# Altium schematic sheet Hardware.SchDoc
size A3; SheetNumber: 1; SheetTotal: 1
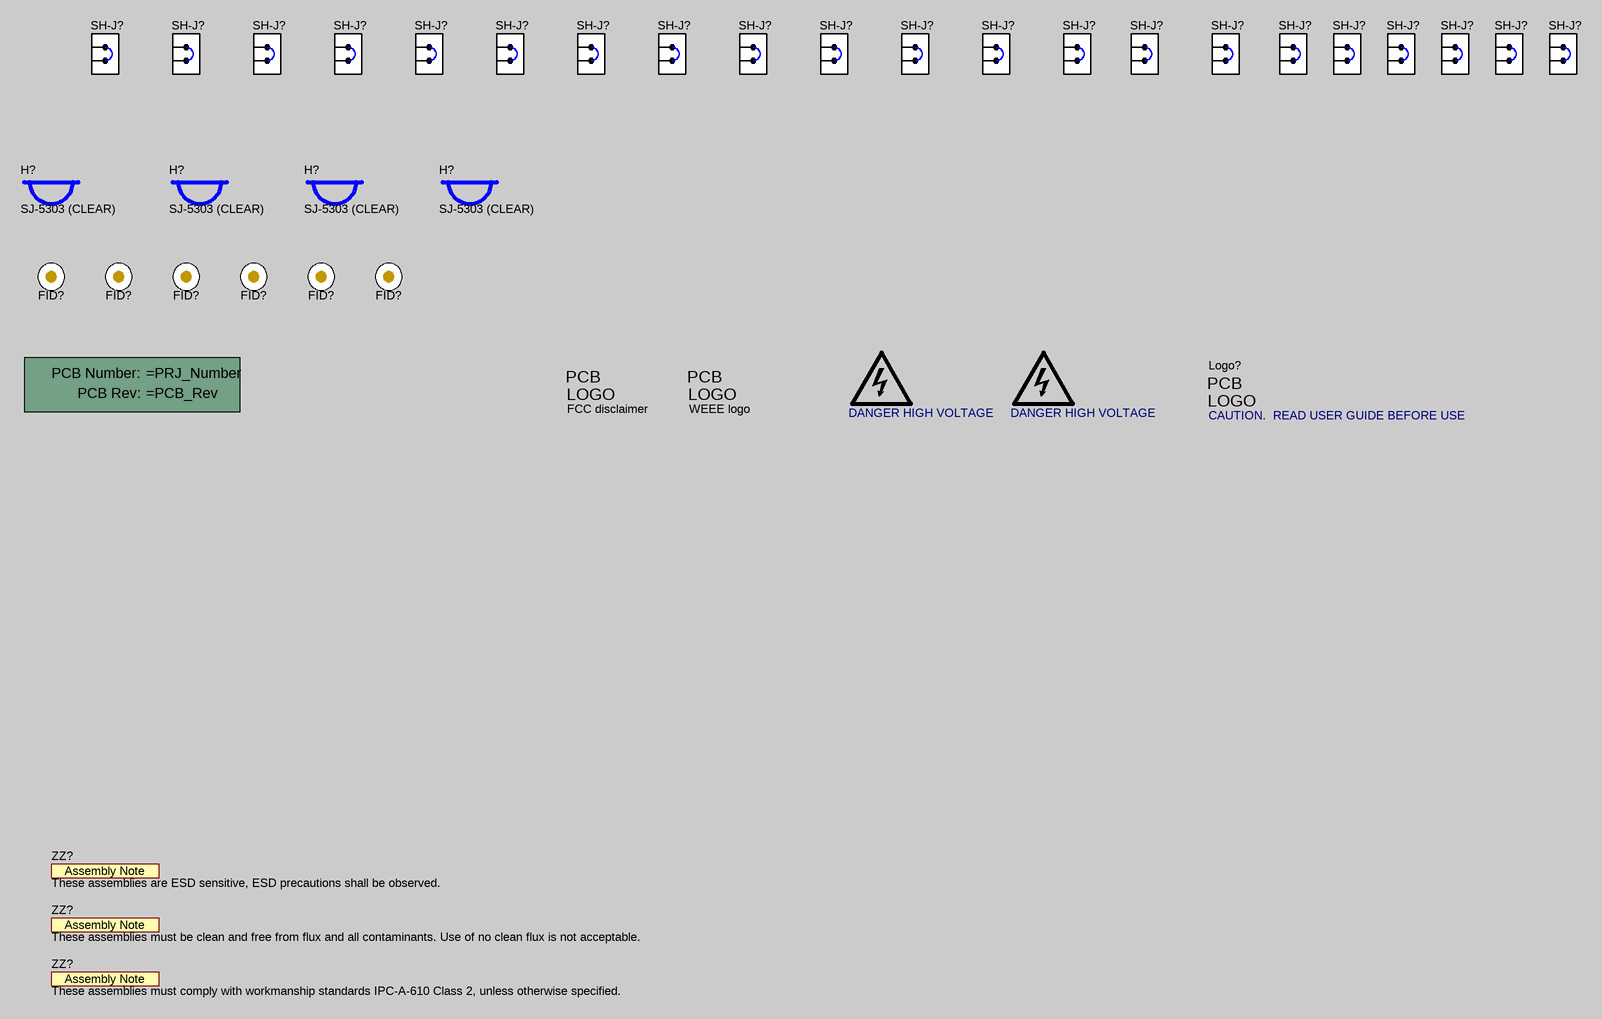
[diagram p0: Hardware.SchDoc]

## Parts
(Parts that share a designator on the sheet are numbered #1, #2 ... from top to bottom, then left to right.)
!PCB?  Printed Circuit Board  (value not drawn)  (mechanical)
FID?#1  Fiducial  [Fiducial10-20]  (value not drawn)
FID?#2  Fiducial  [Fiducial10-20]  (value not drawn)
FID?#3  Fiducial  [Fiducial10-20]  (value not drawn)
FID?#4  Fiducial  [Fiducial10-20]  (value not drawn)
FID?#5  Fiducial  [Fiducial10-20]  (value not drawn)
FID?#6  Fiducial  [Fiducial10-20]  (value not drawn)
H?#1  SJ-5303 (CLEAR)  [Bumpon_SJ5003Transparent]
H?#2  SJ-5303 (CLEAR)  [Bumpon_SJ5003Transparent]
H?#3  SJ-5303 (CLEAR)  [Bumpon_SJ5003Transparent]
H?#4  SJ-5303 (CLEAR)  [Bumpon_SJ5003Transparent]
LOGO?#1  DANGER HIGH VOLTAGE  [IEC_HighVoltage_Medium]  (no BOM)
LOGO?#2  DANGER HIGH VOLTAGE  [IEC_HighVoltage_Medium]  (no BOM)
Logo?#3  FCC disclaimer  [FCC_disclaimer]  (no BOM)
Logo?#4  WEEE logo  [WEEE_Minimum]  (no BOM)
Logo?#5  CAUTION.  READ USER GUIDE BEFORE USE  [IEC_Caution_Medium]  (no BOM)
SH-J?#1  SNT-100-BK-G  [SNT-100-BK-G]  (value not drawn)
SH-J?#2  SNT-100-BK-G  [SNT-100-BK-G]  (value not drawn)
SH-J?#3  SNT-100-BK-G  [SNT-100-BK-G]  (value not drawn)
SH-J?#4  SNT-100-BK-G  [SNT-100-BK-G]  (value not drawn)
SH-J?#5  SNT-100-BK-G  [SNT-100-BK-G]  (value not drawn)
SH-J?#6  SNT-100-BK-G  [SNT-100-BK-G]  (value not drawn)
SH-J?#7  SNT-100-BK-G  [SNT-100-BK-G]  (value not drawn)
SH-J?#8  SNT-100-BK-G  [SNT-100-BK-G]  (value not drawn)
SH-J?#9  SNT-100-BK-G  [SNT-100-BK-G]  (value not drawn)
SH-J?#10  SNT-100-BK-G  [SNT-100-BK-G]  (value not drawn)
SH-J?#11  SNT-100-BK-G  [SNT-100-BK-G]  (value not drawn)
SH-J?#12  SNT-100-BK-G  [SNT-100-BK-G]  (value not drawn)
SH-J?#13  SNT-100-BK-G  [SNT-100-BK-G]  (value not drawn)
SH-J?#14  SNT-100-BK-G  [SNT-100-BK-G]  (value not drawn)
SH-J?#15  SNT-100-BK-G  [SNT-100-BK-G]  (value not drawn)
SH-J?#16  SNT-100-BK-G  [SNT-100-BK-G]  (value not drawn)
SH-J?#17  SNT-100-BK-G  [SNT-100-BK-G]  (value not drawn)
SH-J?#18  SNT-100-BK-G  [SNT-100-BK-G]  (value not drawn)
SH-J?#19  SNT-100-BK-G  [SNT-100-BK-G]  (value not drawn)
SH-J?#20  SNT-100-BK-G  [SNT-100-BK-G]  (value not drawn)
SH-J?#21  SNT-100-BK-G  [SNT-100-BK-G]  (value not drawn)
ZZ?#1  These assemblies are ESD sensitive, ESD precautions shall be observed.  [AssemblyNote]  (no BOM)
ZZ?#2  These assemblies must be clean and free from flux and all contaminants. Use of no clean flux is not acceptable.  [AssemblyNote]  (no BOM)
ZZ?#3  These assemblies must comply with workmanship standards IPC-A-610 Class 2, unless otherwise specified.  [AssemblyNote]  (no BOM)

## Notes on the sheet
- (in symbol CMP-0003618-2) PCB Number:; PCB Rev:
- (in symbol CMP-0074769-1) PCB; LOGO
- (in symbol CMP-0074836-1) PCB; LOGO
- (in symbol CMP-0074847-1) PCB; LOGO

## Library data of the parts
!PCB? = CMP-0003618-2: Manufacturer: Any; CompType: PCB; PartNumber: =PRJ_Number; RoHS: O; MountType: N/A; Publisher: Texas Instruments; LatestRevisionDate: 2017-03-09; Key: PCB
FID?#1-FID?#6 = CMP-0077181-1: Fiducial mark.  There is nothing to buy or mount.; CompType: Fiducial; Manufacturer: N/A; MountType: N/A; PackageReference: N/A; PartNumber: N/A; ClassName: FiducialMark; Library Reference: Fiducial
H?#1-H?#4 = CMP-0003620-1: Bumpon, Hemisphere, 0.44 X 0.20, Clear; Manufacturer: 3M; CompType: Bumpon; PartNumber: SJ-5303 (CLEAR); RoHS: Y; PackageReference: Transparent Bumpon; MountType: N/A; ComponentLink1Description: Datasheet Link; ComponentLink1URL: http://multimedia.mmm.com/mws/mediawebserver.dyn?6666660Zjcf6lVs6EVs666cIsCOrrrrQ-; Publisher: Texas Instruments; LatestRevisionDate: 2017-03-09; Supplier 1: Digi-Key; Supplier Part Number 1: SJ5303-7-ND; Supplier 2: Newark; Supplier Part Number 2: 23M7326; Supplier 3: Mouser; Supplier Part Number 3: 517-SJ-5303CL; Key: SJ-5303 (CLEAR)
LOGO?#1 LOGO?#2 = CMP-0074835-1: IEC 61010-1 High Voltage Warning; SymbolCreator: a0412235; Library Reference: IEC_HighVoltage; Publisher: Texas Instruments; SymbolVersion: 2011-08-22; Published: 2009-03-03; Lib Reference: IEC_HighVoltage; LatestRevisionDate: 2017-07-06; PartNumber: DANGER HIGH VOLTAGE
Logo?#3 = CMP-0074847-1: FCC_disclaimer; Library Reference: Logo; Published: 2009-03-03; Publisher: Texas Instruments; LatestRevisionDate: 2017-07-06; Lib Reference: FCC_disclaimer; PartNumber: FCC disclaimer
Logo?#4 = CMP-0074769-1: Library Reference: WEEE logo; Lib Reference: WEEE logo; PartNumber: WEEE logo
Logo?#5 = CMP-0074836-1: IEC 61010-1 Caution Warning; SymbolCreator: a0412235; Lib Reference: IEC_Caution; Library Reference: Logo; Publisher: Texas Instruments; SymbolVersion: 2011-08-22; Published: 2009-03-03; LatestRevisionDate: 2017-07-06; PartNumber: CAUTION.  READ USER GUIDE BEFORE USE
SH-J?#1-SH-J?#21 = CMP-0003623-3: Shunt, 100mil, Gold plated, Black; Alternate PartNumber: 969102-0000-DA; Manufacturer: Samtec; Alternate Manufacturer: 3M; Value: 1x2; ComponentLink1URL: http://www.samtec.com/ftppub/pdf/SNT.PDF; Supplier 1: Digi-Key; CompType: Shunt; PackageReference: Shunt; ClassName: Shunt; RoHS: Y; Supplier Part Number 1: SAM8858-ND; MountType: N/A; PartNumber: SNT-100-BK-G; ComponentLink1Description: Datasheet Link
ZZ?#1 = CMP-0077236-1: CompType: AssemblyNote; ClassName: AssemblyNote; Publisher: Texas Instruments; LatestRevisionDate: 2017-08-10; Key: AssemblyNote
ZZ?#2 = CMP-0077237-1: CompType: AssemblyNote; ClassName: AssemblyNote; Publisher: Texas Instruments; LatestRevisionDate: 2017-08-10; Key: AssemblyNote
ZZ?#3 = CMP-0077238-1: CompType: AssemblyNote; ClassName: AssemblyNote; Publisher: Texas Instruments; LatestRevisionDate: 2017-08-10; Key: AssemblyNote